# EasyEDA schematic SCH_ESP Hisense 485_2022-09-16.json
TITLE: Sheet_1; REV: 1.0; Date: 2022-08-16; Sheet: 1/1; Drawn By: Vittaly; Company: Your Company
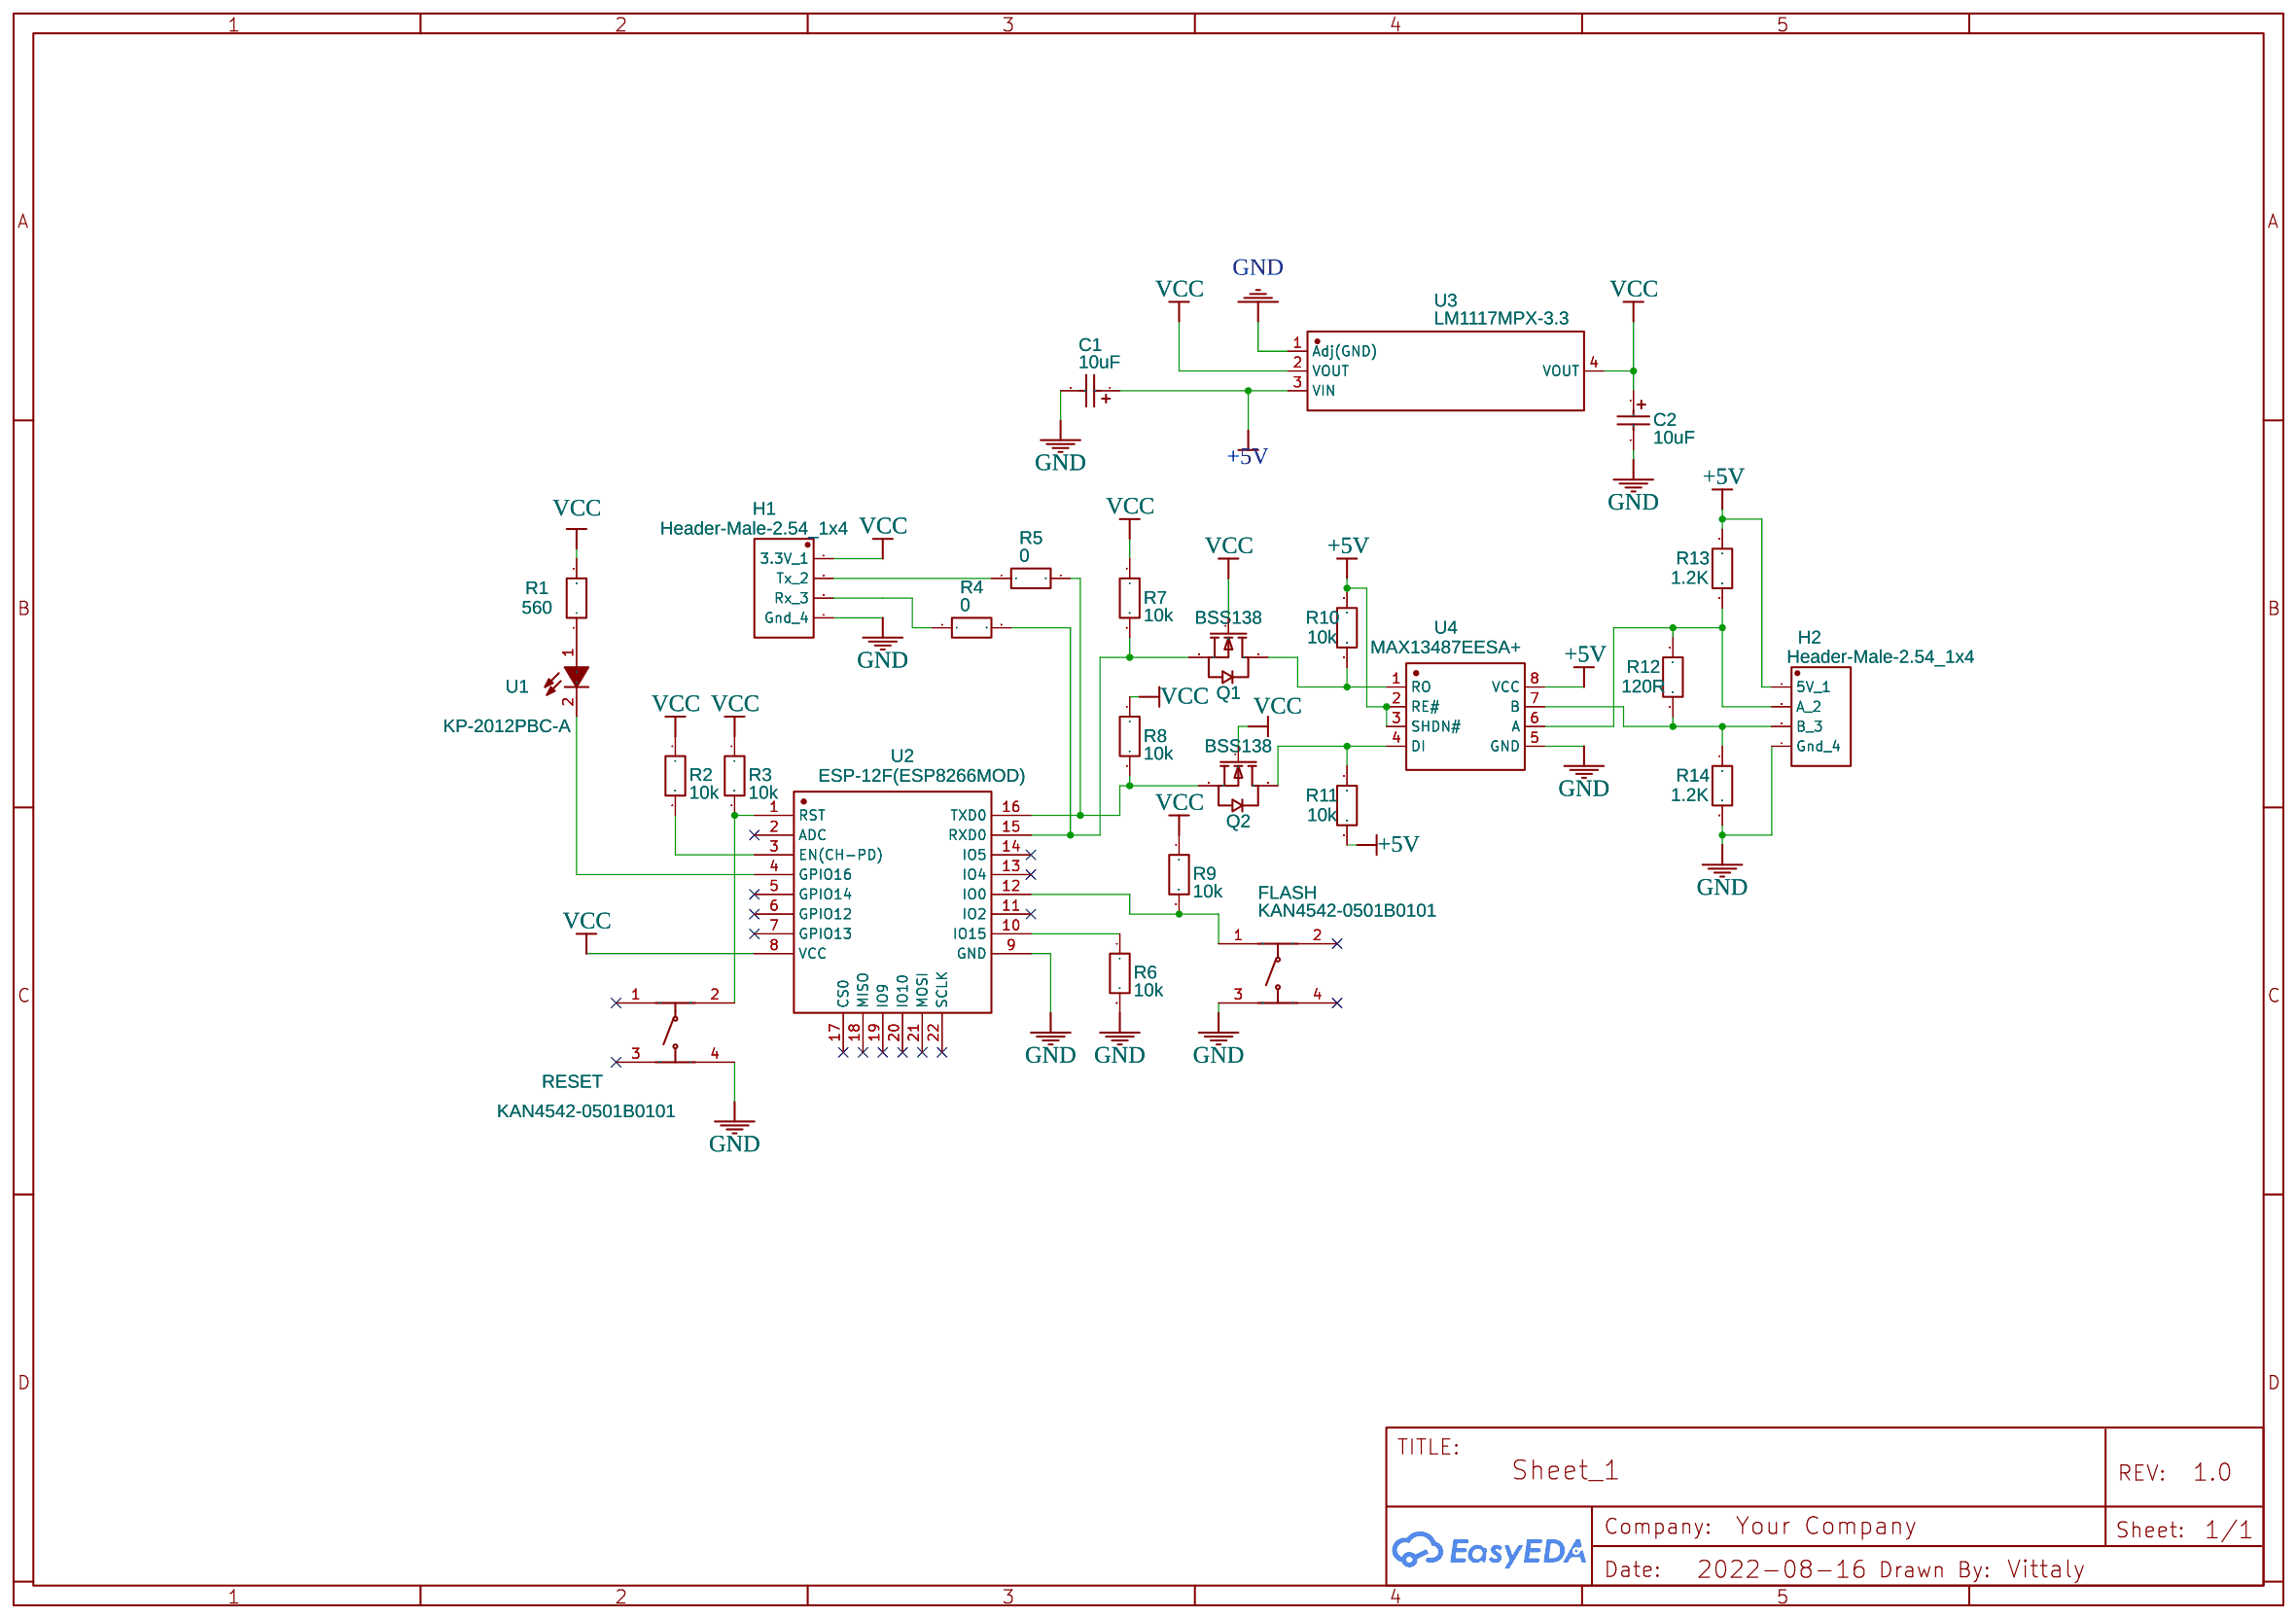
[diagram p0: schematic sheet]

## Parts
C1  10uF  [CAP-SMD_L3.5-W2.8-R-RD]
C2  10uF  [CAP-SMD_L3.5-W2.8-R-RD]
FLASH  KAN4542-0501B0101  [KEY--SMD_4P-L6.2-W6.2-P4.50-LS12.0]
H1  Header-Male-2.54_1x4  [HDR-TH_4P-P2.54-V-M]
H2  Header-Male-2.54_1x4  [HDR-TH_4P-P2.54-V-M]
Q1  BSS138  [SOT-23-3_L2.9-W1.6-P1.90-LS2.8-BR]
Q2  BSS138  [SOT-23-3_L2.9-W1.6-P1.90-LS2.8-BR]
R1  560  [R1206]
R2  10k  [R1206]
R3  10k  [R1206]
R4  0  [R1206]
R5  0  [R1206]
R6  10k  [R1206]
R7  10k  [R1206]
R8  10k  [R1206]
R9  10k  [R1206]
R10  10k  [R1206]
R11  10k  [R1206]
R12  120R  [R1206]
R13  1.2K  [R1206]
R14  1.2K  [R1206]
RESET  KAN4542-0501B0101  [KEY--SMD_4P-L6.2-W6.2-P4.50-LS12.0]
U1  KP-2012PBC-A  [LED0805-R-RD]
U2  ESP-12F(ESP8266MOD)  [WIFIM-SMD_ESP-12F-ESP8266MOD]
U3  LM1117MPX-3.3  [SOT-223_L6.5-W3.5-P2.30-LS7.0-BR]
U4  MAX13487EESA+  [SOIC-8_L4.9-W3.9-P1.27-LS6.0-BL]

## Library data of the parts
C1 C2 = TAJB106M016RNJ: Supplier: LCSC; Manufacturer: AVX; Supplier Part: C8016; JLCPCB Part Class: Extended Part
FLASH RESET = KAN4542-0501B0101: Supplier: LCSC; Supplier Part: C2831431; Manufacturer: GANGYUAN(港源); Contributor: LCSC
H1 H2 = Header-Male-2.54_1x4: Supplier: LCSC; Manufacturer: Ckmtw; Manufacturer Part: 210S-1*4P L=11.6MMGold-plated black; Contributor: LCSC; Supplier Part: C124378; JLCPCB Part Class: Extended Part; Package Display: No
Q1 Q2 = BSS138_C2681829: Supplier: LCSC; Supplier Part: C2681829; Manufacturer: TF; Contributor: LCSC; JLCPCB Part Class: Extended Part
R1-R3 R6 R9 = R_1206_EU: Contributor: LCEDA_Lib
R4 R5 R7 R8 R10-R14 = R_1206_EU: Supplier Part: C138242; Supplier: LCSC; Contributor: LCEDA_Lib; Manufacturer Part: AC1206JR-071KL; Manufacturer: YAGEO
U1 = KP-2012PBC-A: Supplier: LCSC; Supplier Part: C598276; Manufacturer: Kingbright; Contributor: LCSC; JLCPCB Part Class: Extended Part
U2 = ESP-12F(ESP8266MOD): Supplier: LCSC; Manufacturer: Ai-Thinker; Supplier Part: C82891; JLCPCB Part Class: Extended Part
U3 = LM1117MPX-ADJ/NOPB: Supplier: LCSC; Supplier Part: C263277; Manufacturer: Texas Instruments; Contributor: LCSC; JLCPCB Part Class: Extended Part
U4 = MAX13487EESA+: Supplier: LCSC; Manufacturer: MAXIM; Contributor: LCSC; Supplier Part: C143342; JLCPCB Part Class: Extended Part

## Nets
+5V: C1.1 H2.1(5V 1) R10.1 R11.2 R13.1 U3.3(VIN) U4.2(RE#) U4.3(SHDN#) U4.8(VCC)
GND: C1.2 C2.2 FLASH.3 H1.4(Gnd 4) H2.4(Gnd 4) R6.2 R14.2 RESET.4 U2.9(GND) U3.1(Adj(GND)) U4.5(GND)
VCC: C2.1 H1.1(3.3V 1) Q1.1(G) Q2.1(G) R1.2 R2.1 R3.1 R7.1 R8.1 R9.1 U2.8(VCC) U3.2(VOUT) U3.4(VOUT)
Net-(FLASH-1): FLASH.1 R9.2 U2.12(IO0)
Net-(H1-2): H1.2(Tx 2) R5.1
Net-(H1-3): H1.3(Rx 3) R4.1
Net-(H2-2): H2.2(A 2) R12.1 R13.2 U4.6(A)
Net-(H2-3): H2.3(B 3) R12.2 R14.1 U4.7(B)
Net-(Q1-2): Q1.2(S) R4.2 R7.2 U2.15(RXD0)
Net-(Q1-3): Q1.3(D) R10.2 U4.1(RO)
Net-(Q2-2): Q2.2(S) R5.2 R8.2 U2.16(TXD0)
Net-(Q2-3): Q2.3(D) R11.1 U4.4(DI)
Net-(R1-1): R1.1 U1.1(A)
Net-(R2-2): R2.2 U2.3(EN(CH-PD))
Net-(R3-2): R3.2 RESET.2 U2.1(RST)
Net-(R6-1): R6.1 U2.10(IO15)
Net-(U1-2): U1.2(C) U2.4(GPIO16)

Not connected (* = marked no-connect by the designer): FLASH 2* 4*; RESET 1* 3*; U2 2(ADC)* 5(GPIO14)* 6(GPIO12)* 7(GPIO13)* 11(IO2)* 13(IO4)* 14(IO5)* 17(CS0)* 18(MISO)* 19(IO9)* 20(IO10)* 21(MOSI)* 22(SCLK)*
